# Altium schematic sheet SD_Reader.SchDoc: ET4X Full Dock
size A; DrawnBy: KEW; RevisionEngineer: KEW; ProjectTitle: USB-OTG Puck; Revision: X2; SheetNumber: 5; SheetTotal: 5; DrawnByDate: 1/18/2023; ProjectNumber: TBD; AssemblyNumber: TBD; RevisionDate: 7/21/2023; SheetTitle: SD Card; Date: 1/10/2023; ApprovedBy: KEW; CheckedBy: KEW; Author: KEW; CompanyName: Gamber-Johnson LLC.; Engineer: KEW; Organization: Gamber-Johnson LLC.; Address1: 5001 Joerns Dr.; Address2: Stevens Point, WI; Address3: 54481; DocumentNumber: TBD; SPICEModelCacheFYOWLMMU: <root> / <DocumentId>FYOWLMMU</DocumentId> / </root>; Application_BuildNumber: TBD; Time: 9:32AM
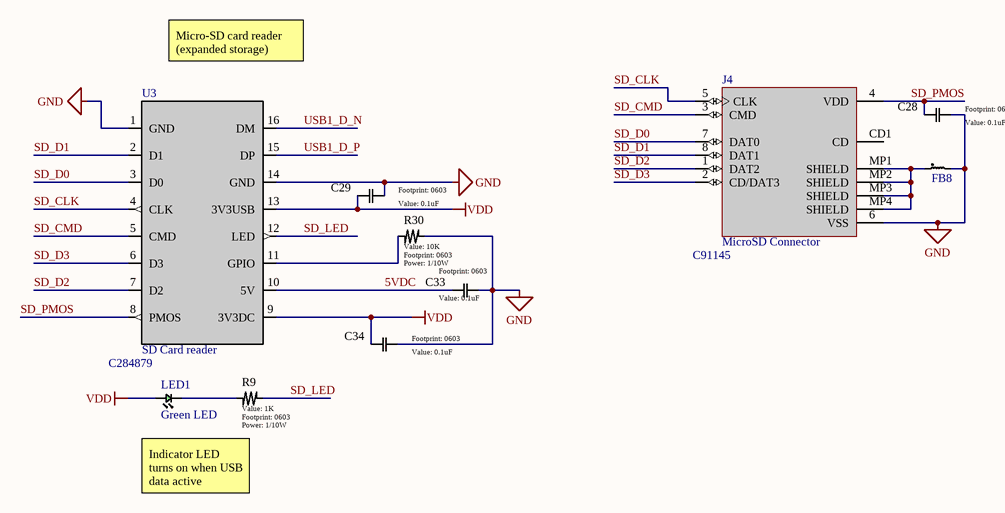
[diagram p0: SD_Reader.SchDoc]

## Parts
C28  value 0.1uF  [0603]  (hidden comment: Generic Capacitor)
C29  value 0.1uF  [0603]  (hidden comment: Generic Capacitor)
C33  value 0.1uF  [0603]  (hidden comment: Generic Capacitor)
C34  value 0.1uF  [0603]  (hidden comment: Generic Capacitor)
FB8  C2971883; PE-0603FB121ST  [0603]  (value not drawn)
J4  MicroSD Connector  LCSC PN: C91145  [TF-01A]
LED1  Green LED  [0603 (1608 Metric) Concave]
R9  value 1K  Power: 1/10W  [0603]  (hidden comment: Generic Resistor)
R30  value 10K  Power: 1/10W  [0603]  (hidden comment: Generic Resistor)
U3  SD Card reader  LCSC PN: C284879  [SSOP-16-150mil]

## Nets
GND: C28.1 C29.1 C33.1 C34.1 FB8.2 J4.6(VSS) R30.1 U3.1(GND) U3.14(GND)
VDD: C29.2 C34.2 LED1.2(Anode) U3.9(3V3DC) U3.13(3V3USB)
5VDC: C33.2 U3.10(5V)
SD_CLK: J4.5(CLK) U3.4(CLK)
SD_CMD: J4.3(CMD) U3.5(CMD)
SD_D0: J4.7(DAT0) U3.3(D0)
SD_D1: J4.8(DAT1) U3.2(D1)
SD_D2: J4.1(DAT2) U3.7(D2)
SD_D3: J4.2(CD/DAT3) U3.6(D3)
SD_LED: R9.1 U3.12(LED)
SD_PMOS: C28.2 J4.4(VDD) U3.8(PMOS)
USB1_D_N: U3.16(DM)
USB1_D_P: U3.15(DP)
NetFB8_1: FB8.1 J4.MP1(SHIELD) J4.MP2(SHIELD) J4.MP3(SHIELD) J4.MP4(SHIELD)
NetLED1_1: LED1.1(Cathode) R9.2
NetR30_2: R30.2 U3.11(GPIO)

Not connected (* = marked no-connect by the designer): J4 CD1(CD)

## Notes on the sheet
- Micro-SD card reader
  (expanded storage)
- Indicator LED turns on when USB data active
- REV
- REVISIONS
- DATE
- DESCRIPTION
- BY
- UNLESS OTHERWISE SPECIFIED, DRAWING DEFINITIONS AND TOLERANCES SHALL BE FOUND UNDER SUPPLIER STANDARDS SS-001. THIS PART AND ALL COMPONENTS OF IT MUST BE RoHS & REACH COMPLIANT. A CERTIFICATE OF COMPLIANCE MUST BE PROVIDED UPON REQUEST.
- ALL INFORMATION ON THIS DOCUMENT IS THE SOLE PROPERTY OF GAMBER-JOHNSON AND SHALL NOT BE COPIED, REPRODUCED, USED OR DISCLOSED IN WHOLE OR IN PART WITHOUT THE WRITTEN CONSENT OF GAMBER-JOHNSON
- TOLERANCES
  .00 ± .060
  .000 ± .020
  .0000 ± .005
  ANGELS ± 1°
- DRAWN BY:
- PROJECT NUMBER:
- SHEET TITLE:
- SHEET
- OF
- DATE:
- LOCATION:
- ASSEMBLY NUMBER
- SIZE
- GAMBER-JOHNSON LLC
  5001 JOERNS DR.
  STEVENS POINT, WI 54481
  +1 (715) 344-5209
- B

## Library data of the parts
C28 C29 C33 C34 = Generic Capacitor: Voltage: >10V; Tolerance: 10%
FB8 = PE-0603FB121ST: 120 Ohms @ 100 MHz 1 Signal Line Ferrite Bead 0603 (1608 Metric) 500mA 180mOhm; Manufacturer: Pulse; Number of Lines: 1; DC Resistance (DCR): 180mR; Supplier 1: Digi-Key; Supplier Part Number 1: 553-2382-1-ND; Manufacturer Part Number: PE-0603FB121ST; RoHS: Yes; Category: Inductors; Stock 1: 6181; Pricing 1: 1=0.10000, 10=0.04400, 25=0.03920, 50=0.03580, 100=0.03220, 250=0.02360, 500=0.01716, 1000=0.01680 (USD); Mount: Surface Mount; Case/Package: 0603; Case Code (Metric): 1608; Case Code (Imperial): 0603; Min Operating Temperature: -40°C; Max Operating Temperature: 105°C; Package Quantity: 4000; Packaging: Tape and Reel; Max Current Rating: 500mA; Length: 0.063inch; Width: 0.031inch; Height: 0.037inch; RoHS Compliant: Yes; ComponentLink1URL: https://productfinder.pulseeng.com/doc_type/WEB301/doc_num/WC706/doc_part/WC706.pdf?src-supplier=Digi-Key; ComponentLink1Description: https://productfinder.pulseeng.com/doc_type/WEB301/doc_num/WC706/doc_part/WC706.pdf?src-supplier=Digi-Key; ComponentLink2URL: http://productfinder.pulseeng.com/products/datasheets/WC706.pdf?src-supplier=Digi-Key; ComponentLink2Description: http://productfinder.pulseeng.com/products/datasheets/WC706.pdf?src-supplier=Digi-Key; LCSC PN: C127301
J4 = TF-01A: Deck MicroSD card (TF card) Self bomb SMD SD Card Connector
LED1 = LTST-C191KGKT: LED Uni-Color Green 574nm 2-Pin Chip LED T/R; Manufacturer 1: Vishay Lite-On; Lens Color: Colorless; Luminous Intensity: 35mcd; Viewing Angle: 130°; Forward Voltage: 2V; Dominant Wavelength: 571nm; Test Current: 20mA; Lens Transparency: Clear; Lens Style: Rectangular,Colorless; Forward Current: 30mA; Number of Elements: 1; Power Dissipation: 75mW; Reverse Voltage: 5V; Supplier 1: RSComponents; Manufacturer Part Number 1: LTST-C191KGKT; RoHS: Yes; Category: LEDs; Stock 1: 4150; Pricing 1: 50=0.14800, 250=0.06800, 500=0.06400, 1250=0.05400, 2500=0.05100 (USD); Mount: Surface Mount; Case/Package: 0603; Number of Pins: 2; Color: Green; Case Code (Metric): 1608; Case Code (Imperial): 0603; Min Operating Temperature: -55°C; Max Operating Temperature: 85°C; Packaging: Tape and Reel; Package Quantity: 1; Wavelength: 574nm; Illumination Color: Green; Number of LEDs: 1; Power Rating: 75mW; Max Power Dissipation: 75mW; Length: 1.6mm; Width: 0.8mm; Height: 0.55mm; Depth: 0.8mm; Radiation Hardening: No; Lead Free: Lead Free; RoHS Compliant: Yes; ComponentLink1URL: https://datasheet.ciiva.com/2109/ltst-c191kgkt-2109973.pdf?src-supplier=Digi-Key; ComponentLink1Description: https://datasheet.ciiva.com/2109/ltst-c191kgkt-2109973.pdf?src-supplier=Digi-Key; Supplier Part Number 1: 6921010
R9 R30 = Generic Resistor: Tolerance: 1%
U3 = GL823K-HCY04: USB 2.0 SD/MSPRO Card Reader Controller